# Altium schematic sheet STM32_Interfaces.SchDoc
size A; SheetNumber: 5; SheetTotal: 5
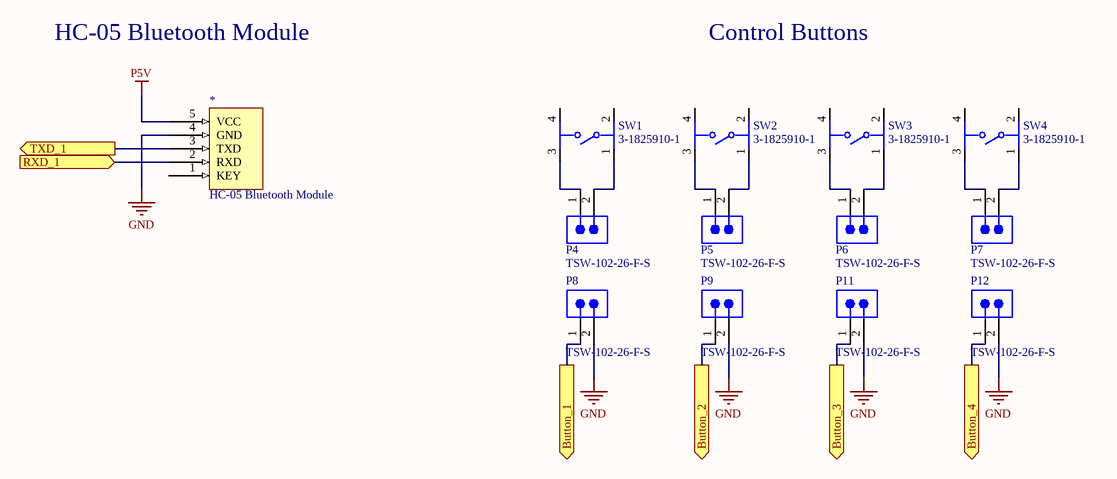
[diagram p0: STM32_Interfaces.SchDoc]

## Parts
*  HC-05 Bluetooth Module  [HC-05 Bluetooth Module]
P4  TSW-102-26-F-S  [SMTC-TSW-102-26-XX-S]
P5  TSW-102-26-F-S  [SMTC-TSW-102-26-XX-S]
P6  TSW-102-26-F-S  [SMTC-TSW-102-26-XX-S]
P7  TSW-102-26-F-S  [SMTC-TSW-102-26-XX-S]
P8  TSW-102-26-F-S  [SMTC-TSW-102-26-XX-S]
P9  TSW-102-26-F-S  [SMTC-TSW-102-26-XX-S]
P11  TSW-102-26-F-S  [SMTC-TSW-102-26-XX-S]
P12  TSW-102-26-F-S  [SMTC-TSW-102-26-XX-S]
SW1  3-1825910-1  [FP-3-1825910-1-MFG]
SW2  3-1825910-1  [FP-3-1825910-1-MFG]
SW3  3-1825910-1  [FP-3-1825910-1-MFG]
SW4  3-1825910-1  [FP-3-1825910-1-MFG]

## Ports
Button_1 (out), Button_2 (out), Button_3 (out), Button_4 (out), RXD_1 (in), TXD_1 (out)

## Nets
GND: *.4(GND) P8.2 P9.2 P11.2 P12.2
P5V: *.5(VCC)
Button_1: P8.1 ; port Button_1
Button_2: P9.1 ; port Button_2
Button_3: P11.1 ; port Button_3
Button_4: P12.1 ; port Button_4
RXD_1: *.2(RXD) ; port RXD_1
TXD_1: *.3(TXD) ; port TXD_1
NetP4_1: P4.1 SW1.3
NetP4_2: P4.2 SW1.1
NetP5_1: P5.1 SW2.3
NetP5_2: P5.2 SW2.1
NetP6_1: P6.1 SW3.3
NetP6_2: P6.2 SW3.1
NetP7_1: P7.1 SW4.3
NetP7_2: P7.2 SW4.1

Not connected (* = marked no-connect by the designer): * 1(KEY); SW1 2 4; SW2 2 4; SW3 2 4; SW4 2 4

## Notes on the sheet
- HC-05 Bluetooth Module
- Control Buttons

## Library data of the parts
P4-P9 P11 P12 = CMP-002-00072-1: Headers & Wire Housings Classic PCB Header Strips, 0.100 pitch; Number of Positions: 2; Max Voltage Rating (AC): 550V; Gender: Male; Pitch: 2.54mm; Contact Post Length: 3.2mm; Voltage Rating: 500V; Max Current Rating: 7.6A; Contact Material: Bronze; Contact Gender: Male; Contact Type: -; REACH SVHC: No SVHC; Min Operating Temperature: -55°C; Housing Material: Polyester; Packaging: Bulk; Termination: Through Hole; Max Operating Temperature: 125°C; Orientation: Vertical; Flammability Rating: UL94 V-0; Package Quantity: 1; Depth: 2.54mm; Contact Plating: Gold; Number of Rows: 1; Radiation Hardening: No; Number of Contacts: 2; Length: 5.08mm; RoHS Compliant: Yes; Housing Color: Black; Weight: 0.001257oz; Contact Mating Length: 5.84mm; Series: TSW
SW1-SW4 = CMP-03407-000001-1: SWITCH TACTILE SPST-NO 0.05A 24V; Manufacturer: TE Connectivity; Operating Force: 160gf; Contact Current Rating: 50mA; Contact Resistance: 100mΩ; Electromechanical Life: 100000Cycles; Device Class L1: Electromechanical; ComponentLink2URL: https://www.te.com/commerce/DocumentDelivery/DDEController?Action=srchrtrv&DocNm=1825910&DocType=Customer+Drawing&DocLang=English; Category: Switch; Device Class L2: Switches; Temperature: -35°C to +85°C; RoHS: TRUE; Mount: Through Hole; Manufacturer Part Number: 3-1825910-1; Automotive: No; Lead Free: Yes; Device Class L3: Tactile Switches; ComponentLink2Description: Datasheet; Temperature Range High: +85°C; Height: 17.3mm; Package: 0; Temperature Range Low: -35°C; Throw Configuration: SPST-NO; Digikey Description: SWITCH TACTILE SPST-NO 0.05A 24V; Octopart: https://octopart.com/3-1825910-1-te+connectivity-46506874